# EAGLE design tiny-psu-main-v1.1 (EAGLE 9.6.2)

## Sheet 1 of 2
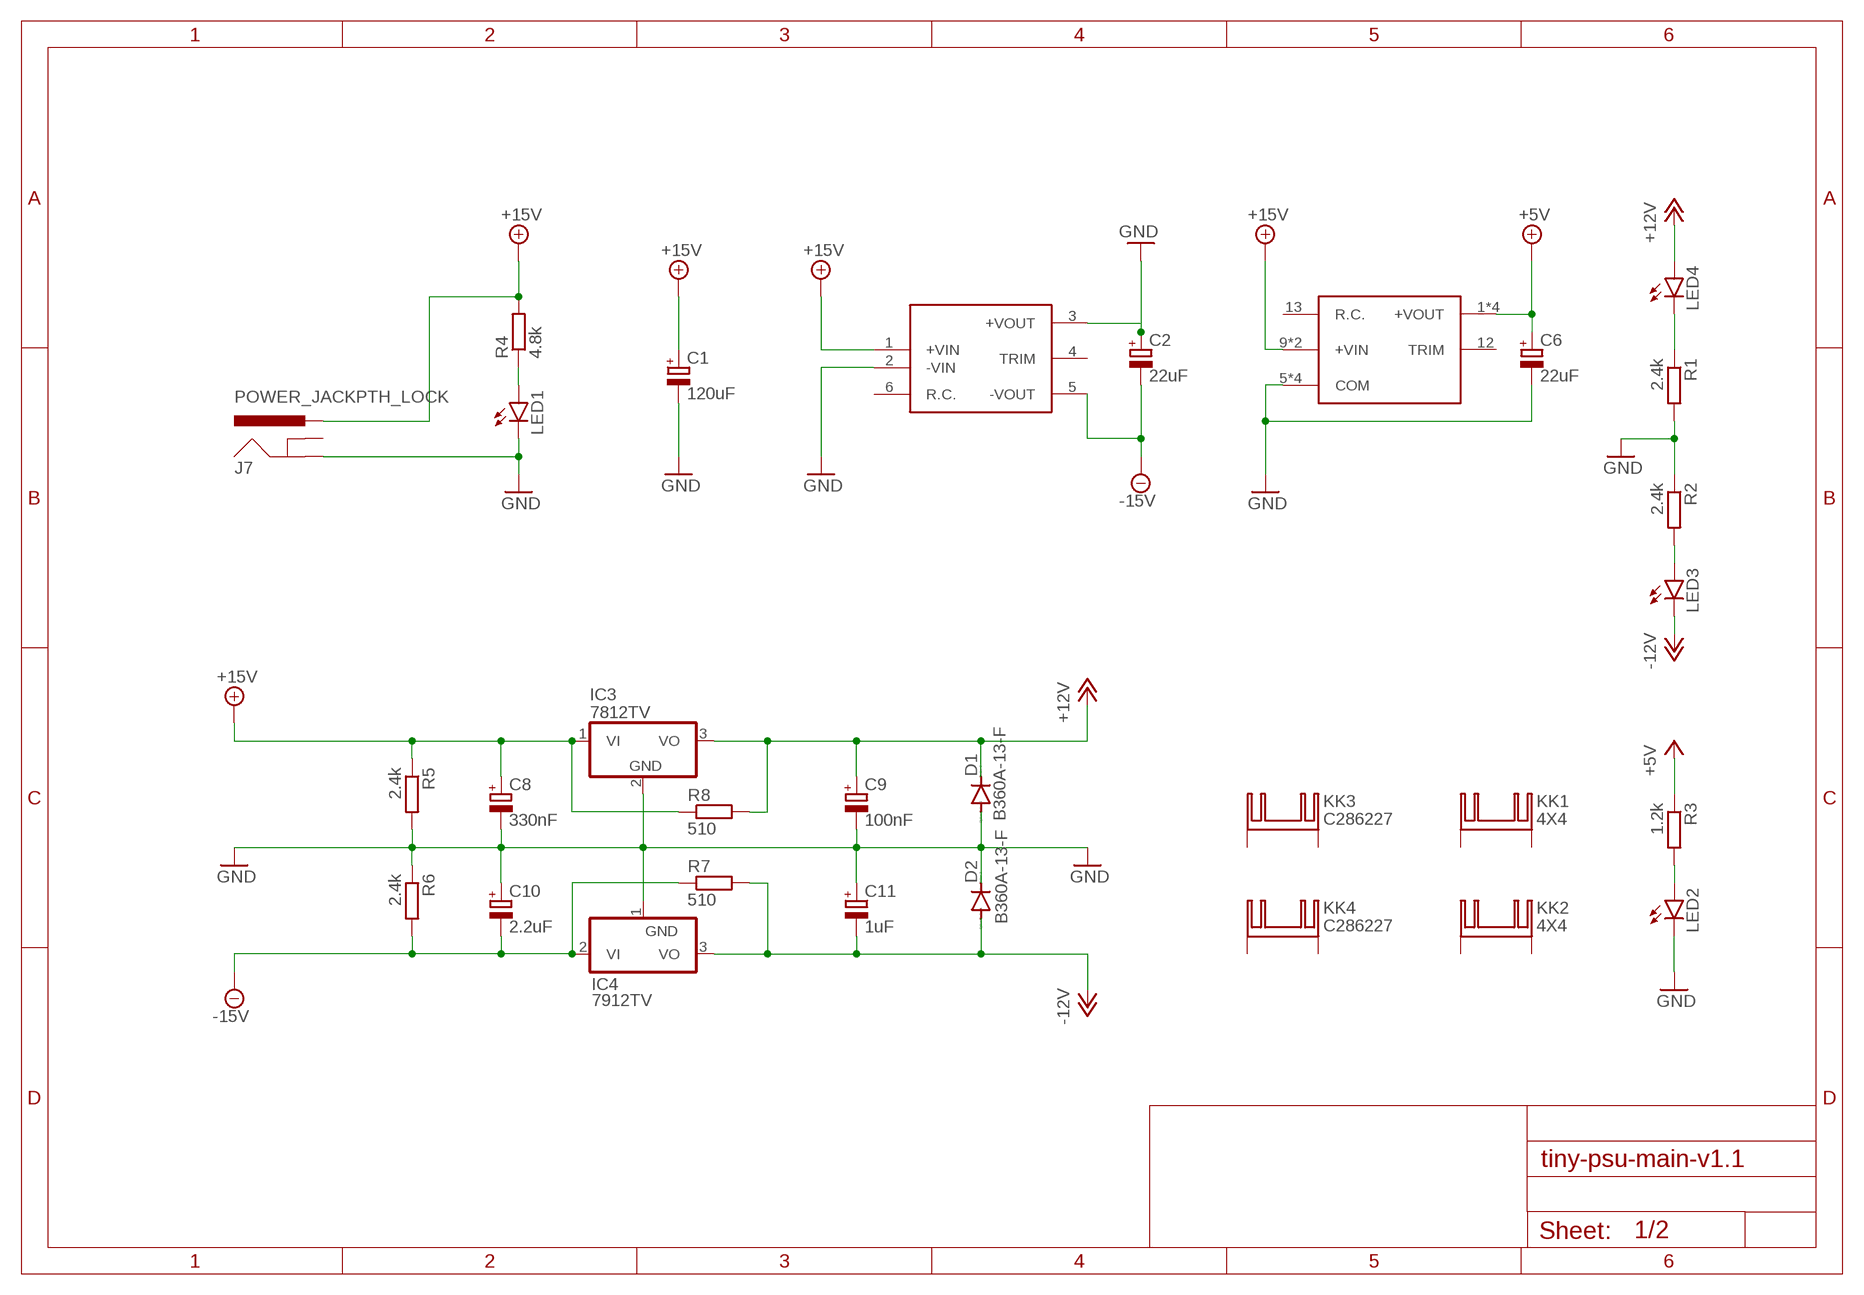
[diagram p0: schematic, sheet 1]

### Parts
C1  120uF  CPOL-EUE5-10.5  [E5-10,5]
C2  22uF  CPOL-EUE2.5-6  [E2,5-6]
C6  22uF  CPOL-EUE2.5-6  [E2,5-6]
C8  330nF  C-POL_TANTALUM-1206(3216-METRIC)  [CAPMP3216X180N]
C9  100nF  C-POL_TANTALUM-1206(3216-METRIC)  [CAPMP3216X180N]
C10  2.2uF  C-POL_TANTALUM-1411(3528-METRIC)  [CAPMP3528X210N]
C11  1uF  C-POL_TANTALUM-1206(3216-METRIC)  [CAPMP3216X180N]
D1  B360A-13-F  DIODE-DO-214AC  [DO-214AC]
D2  B360A-13-F  DIODE-DO-214AC  [DO-214AC]
IC1  SKMW  [SKMW]
IC2  NID100-5  NID65-HORIZONTAL  [NID65-HORIZONTAL]
IC3  7812TV  [TO220V]
IC4  7912TV  [TO220V]
J7  POWER_JACKPTH_LOCK  [POWER_JACK_PTH_LOCK]
KK1  4X4  [4X4]
KK2  4X4  [4X4]
KK3  C286227  [C286227]
KK4  C286227  [C286227]
LED1  LEDCHIP-LED0805  [CHIP-LED0805]
LED2  LEDCHIP-LED0805  [CHIP-LED0805]
LED3  LEDCHIP-LED0805  [CHIP-LED0805]
LED4  LEDCHIP-LED0805  [CHIP-LED0805]
R1  2.4k  R-EU_R0805  [R0805]
R2  2.4k  R-EU_R0805  [R0805]
R3  1.2k  R-EU_R0805  [R0805]
R4  4.8k  R-EU_R0805  [R0805]
R5  2.4k  R-EU_R0805  [R0805]
R6  2.4k  R-EU_R0805  [R0805]
R7  510  R-EU_R0805  [R0805]
R8  510  R-EU_R0805  [R0805]

### Nets
+5V: C6.+ IC2.1(+VOUT) IC2.2(+VOUT) IC2.3(+VOUT) IC2.4(+VOUT) R3.1 ; also sheet 2
+12V: C9.1(+) D1.C IC3.3(VO) LED4.A R8.2 ; also sheet 2
+15V: C1.+ C8.1(+) IC1.1(+VIN) IC2.9(+VIN) IC2.10(+VIN) IC3.1(VI) J7.PWR R4.2 R5.1 R8.1
-12V: C11.2(-) D2.A IC4.3(VO) LED3.C R7.2 ; also sheet 2
-15V: C2.- C10.2(-) IC1.5(-VOUT) IC4.2(VI) R6.2 R7.1
GND: C1.- C2.+ C6.- C8.2(-) C9.2(-) C10.1(+) C11.1(+) D1.A D2.C IC1.2(-VIN) IC1.3(+VOUT) IC2.5(COM) IC2.6(COM) IC2.7(COM) IC2.8(COM) IC3.2(GND) IC4.1(GND) J7.GND LED1.C LED2.C R1.2 R2.1 R5.2 R6.1 ; also sheet 2
N$1: LED4.C R1.1
N$3: LED3.A R2.2
N$7: LED1.A R4.1
N$10: LED2.A R3.2
Unconnected: IC1.4(TRIM) IC1.6(R.C.) IC2.12(TRIM) IC2.13(R.C.) J7.GNDBREAK KK1.A2,1(K) KK1.A2,2(K) KK1.B2,1(K) KK1.B2,2(K) KK2.A2,1(K) KK2.A2,2(K) KK2.B2,1(K) KK2.B2,2(K) KK3.A2,2(K) KK3.B2,2(K) KK4.A2,2(K) KK4.B2,2(K)

## Sheet 2 of 2
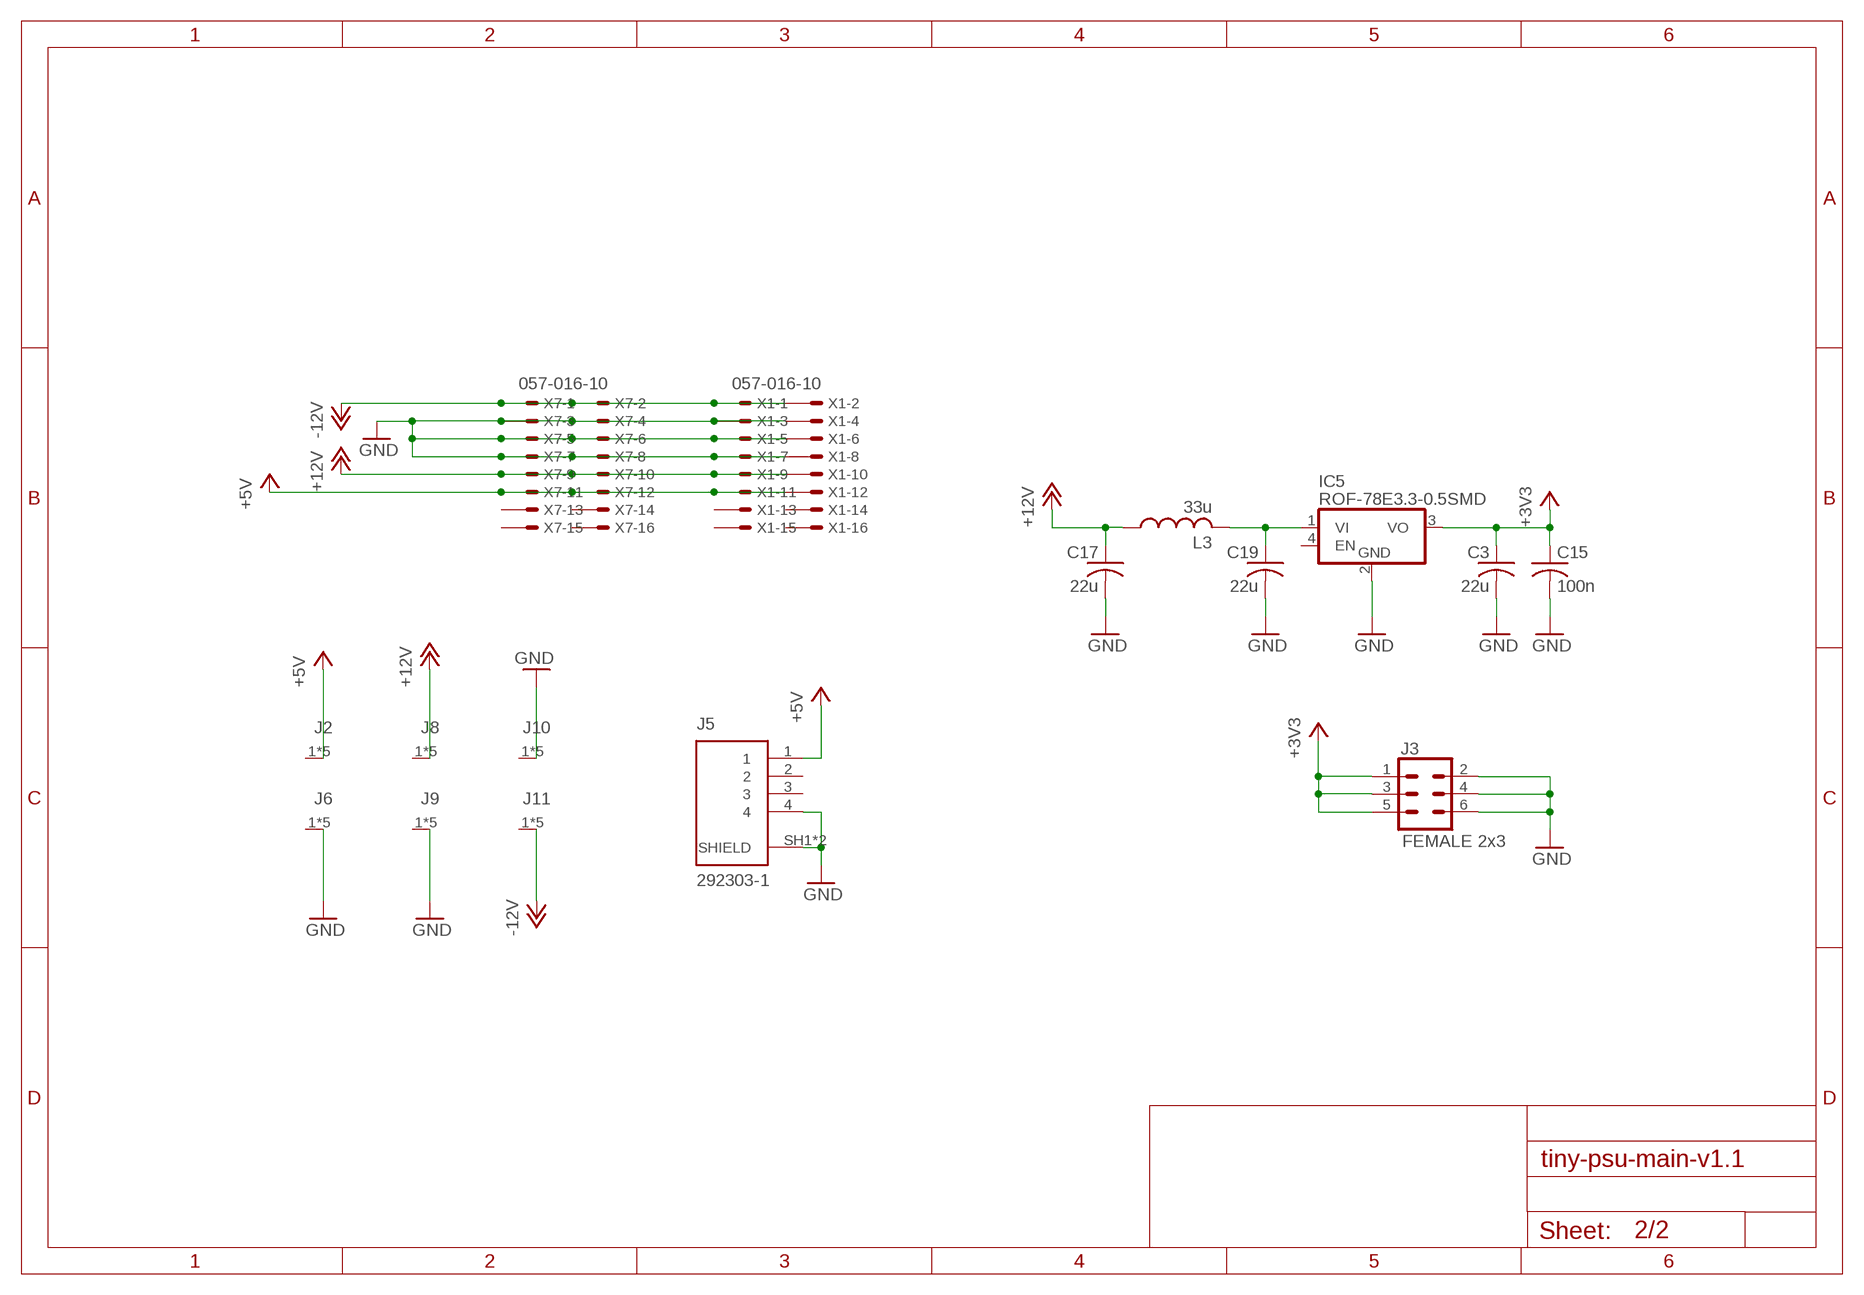
[diagram p1: schematic, sheet 2]

### Parts
C3  22u  C-USC1206  [C1206]
C15  100n  C-USC0402  [C0402]
C17  22u  C-USC1206  [C1206]
C19  22u  C-USC1206  [C1206]
IC5  ROF-78E3.3-0.5SMD  ROF-78EXX-0.55SMD  [ROF78EXX-0.5SMD]
J2  30A-SCREW-CONN  [50X72]
J3  FEMALE 2x3  CONN_03X2FEMALE  [2X3]
J5  292303-1  [292303-1]
J6  30A-SCREW-CONN  [50X72]
J8  30A-SCREW-CONN  [50X72]
J9  30A-SCREW-CONN  [50X72]
J10  30A-SCREW-CONN  [50X72]
J11  30A-SCREW-CONN  [50X72]
L3  33u  L-USL2012C  [L2012C]
X1  057-016-10  [057-016-1]
X7  057-016-10  [057-016-1]

### Nets
+3V3: C3.1 C15.1 IC5.3(VO) J3.1 J3.3 J3.5
+5V: J2.1 J2.2 J2.3 J2.4 J2.P$1 J5.1 X1.11 X1.12 X7.11 X7.12 ; also sheet 1
+12V: C17.1 J8.1 J8.2 J8.3 J8.4 J8.P$1 L3.1 X1.9 X1.10 X7.9 X7.10 ; also sheet 1
-12V: J11.1 J11.2 J11.3 J11.4 J11.P$1 X1.1 X1.2 X7.1 X7.2 ; also sheet 1
GND: C3.2 C15.2 C17.2 C19.2 IC5.2(GND) J3.2 J3.4 J3.6 J5.4 J5.SH1(SHIELD) J5.SH2(SHIELD) J6.1 J6.2 J6.3 J6.4 J6.P$1 J9.1 J9.2 J9.3 J9.4 J9.P$1 J10.1 J10.2 J10.3 J10.4 J10.P$1 X1.3 X1.4 X1.5 X1.6 X1.7 X1.8 X7.3 X7.4 X7.5 X7.6 X7.7 X7.8 ; also sheet 1
N$99: C19.1 IC5.1(VI) L3.2
Unconnected: IC5.4(EN) J5.2 J5.3 X1.13 X1.14 X1.15 X1.16 X7.13 X7.14 X7.15 X7.16

## Library data of the parts
C1 C2 C6 = rcl:CPOL-EU: POLARIZED CAPACITOR, European symbol; SPICEPREFIX: C
C3 C15 C17 C19 = rcl:C-US: CAPACITOR, American symbol
C8-C11 = Capacitor:C-POL: Capacitor Polarised - Generic; CATEGORY: Capacitor
D1 D2 = diode:DIODE-: DIODE
IC1 = meanwell_dcdc:SKMW
IC2 = meanwell_dcdc:NID65-HORIZONTAL
IC3 = ldo:78*: Positive VOLTAGE REGULATOR Source: http://cache.national.com/ds/LM/LM78L05.pdf http://www.fairchildsemi.com/ds/LM/LM7805.pdf
IC4 = ldo:79*: Positive VOLTAGE REGULATOR Source: http://cache.national.com/ds/LM/LM78L05.pdf http://www.fairchildsemi.com/ds/LM/LM7805.pdf
IC5 = og-vreg:ROF-78EXX-0.55SMD
J2 J6 J8-J11 = conn-screw:30A-SCREW-CONN
J3 = SparkFun-Connectors:CONN_03X2: Multi connection point. Often used as Generic Header-pin footprint for 0.1 inch spaced/style header connections You can populate with any combo of single row headers, but if you'd like an exact match, check these: Header - 2x3 (Male, 0.1") <https://www.sparkfun.com/products/12807> (PRT-12807) Header - 2x3 (Female, 0.1") <https://www.sparkfun.com/products/13010> (PRT-13010) 2x3 Pin Shrouded Header <https://www.sparkfun.com/products/10877> (PRT-10877) On any of the 0.1 inch spaced packages, you can populate with these: Break Away Headers - Straight <https://www.sparkfun.com/products/116> (PRT-00116) Break Away Male Headers - Right Angle <https://www.sparkfun.com/products/553> (PRT-00553) Female Headers <https://www.sparkfun.com/products/115> (PRT-00115) Break Away Headers - Machine Pin <https://www.sparkfun.com/products/117> (PRT-00117) Break Away Female Headers - Swiss Machine Pin <https://www.sparkfun.com/products/743> (PRT-00743) Special note: the shrouded connector mates well with our 3x2 ribbon cables: Ribbon Crimp Connector - 6-pin (2x3, Female) <https://www.sparkfun.com/products/10651> (PRT-10651) Ribbon Cable - 6 wire (15ft) <https://www.sparkfun.com/products/10646> (PRT-10646); PROD_ID: CONN-11566
J5 = USB connector:292303-1: CONN RCPT USB2.0 TYPEA 4POS R/A Manufacturer's datasheet <https://www.te.com/commerce/DocumentDelivery/DDEController?Action=srchrtrv&DocNm=292303&DocType=Customer+Drawing&DocLang=English>; CREATED_BY: PCBLayout.com; DIGIKEY_PARTNO: A31726-ND; MANUFACTURER: TE Connectivity AMP Connectors; MPN: 292303-1
J7 = SparkFun-Connectors:POWER_JACK: Power Jack Connector This is the standard 5.5mm barrel jack for power. The PTH is the most common, proven, reliable, footprint. The Slot footprint only works if the mill layer is transmitted to the PCB fab house so be warned. Here are the connectors we sell at SparkFun: DC Barrel Power Jack/Connector <https://www.sparkfun.com/products/119> (PRT-00119) DC Barrel Power Jack/Connector (SMD) <https://www.sparkfun.com/products/12748> (PRT-12748) DC Barrel Jack Adapter - Breadboard Compatible <https://www.sparkfun.com/products/10811> (PRT-10811) It is used on this SparkFun product (and many, many others): SparkFun RedBoard - Programmed with Arduino <https://www.sparkfun.com/products/12757> (DEV-12757) Also, if you need a mating power supply or connector, please check these out: Wall Adapter Power Supply - 9VDC 650mA <https://www.sparkfun.com/products/298> (TOL-00298) DC Barrel Jack Adapter - Male <https://www.sparkfun.com/products/10287> (PRT-10287); PROD_ID: CONN-08197; SF_ID: PRT-00119
KK1 KK2 = biti:4X4: HEATSINK manufacturer Fischer/distributor Buerklin
KK3 KK4 = biti:C286227: HEATSINK manufacturer Fischer/distributor Buerklin
L3 = og-rcl:L-US
LED1-LED4 = led:LED: LED OSRAM: - CHIPLED LG R971, LG N971, LY N971, LG Q971, LY Q971, LO R971, LY R971 LH N974, LH R974 LS Q976, LO Q976, LY Q976 LO Q996 - Hyper CHIPLED LW Q18S LB Q993, LB Q99A, LB R99A - SideLED LS A670, LO A670, LY A670, LG A670, LP A670 LB A673, LV A673, LT A673, LW A673 LH A674 LY A675 LS A676, LA A676, LO A676, LY A676, LW A676 LS A679, LY A679, LG A679 - Hyper Micro SIDELED® LS Y876, LA Y876, LO Y876, LY Y876 LT Y87S - SmartLED LW L88C, LW L88S LB L89C, LB L89S, LG L890 LS L89K, LO L89K, LY L89K LS L896, LA L896, LO L896, LY L896 - TOPLED LS T670, LO T670, LY T670, LG T670, LP T670 LSG T670, LSP T670, LSY T670, LOP T670, LYG T670 LG T671, LOG T671, LSG T671 LB T673, LV T673, LT T673, LW T673 LH T674 LS T676, LA T676, LO T676, LY T676, LB T676, LH T676, LSB T676, LW T676 LB T67C, LV T67C, LT T67C, LS T67K, LO T67K, LY T67K, LW E67C LS E67B, LA E67B, LO E67B, LY E67B, LB E67C, LV E67C, LT E67C LW T67C LS T679, LY T679, LG T679 LS T770, LO T770, LY T770, LG T770, LP T770 LB T773, LV T773, LT T773, LW T773 LH T774 LS E675, LA E675, LY E675, LS T675 LS T776, LA T776, LO T776, LY T776, LB T776 LHGB T686 LT T68C, LB T68C - Hyper Mini TOPLED® LB M676 - Mini TOPLED Santana® LG M470 LS M47K, LO M47K, LY M47K Source: http://www.osram.convergy.de LUXEON: - LUMILED® LXK2-PW12-R00, LXK2-PW12-S00, LXK2-PW14-U00, LXK2-PW14-V00 LXK2-PM12-R00, LXK2-PM12-S00, LXK2-PM14-U00 LXK2-PE12-Q00, LXK2-PE12-R00, LXK2-PE12-S00, LXK2-PE14-T00, LXK2-PE14-U00 LXK2-PB12-K00, LXK2-PB12-L00, LXK2-PB12-M00, LXK2-PB14-N00, LXK2-PB14-P00, LXK2-PB14-Q00 LXK2-PR12-L00, LXK2-PR12-M00, LXK2-PR14-Q00, LXK2-PR14-R00 LXK2-PD12-Q00, LXK2-PD12-R00, LXK2-PD12-S00 LXK2-PH12-R00, LXK2-PH12-S00 LXK2-PL12-P00, LXK2-PL12-Q00, LXK2-PL12-R00 Source: www.luxeon.com KINGBRIGHT: KA-3528ASYC Source: www.kingbright.com
R1-R8 = rcl:R-EU_: RESISTOR, European symbol; SPICEPREFIX: R
X1 X7 = conn-fc:057-016-1: CONNECTOR 10-pin series 057 contact pc board low profile headers; OC_FARNELL: unknown; OC_NEWARK: unknown

## Board
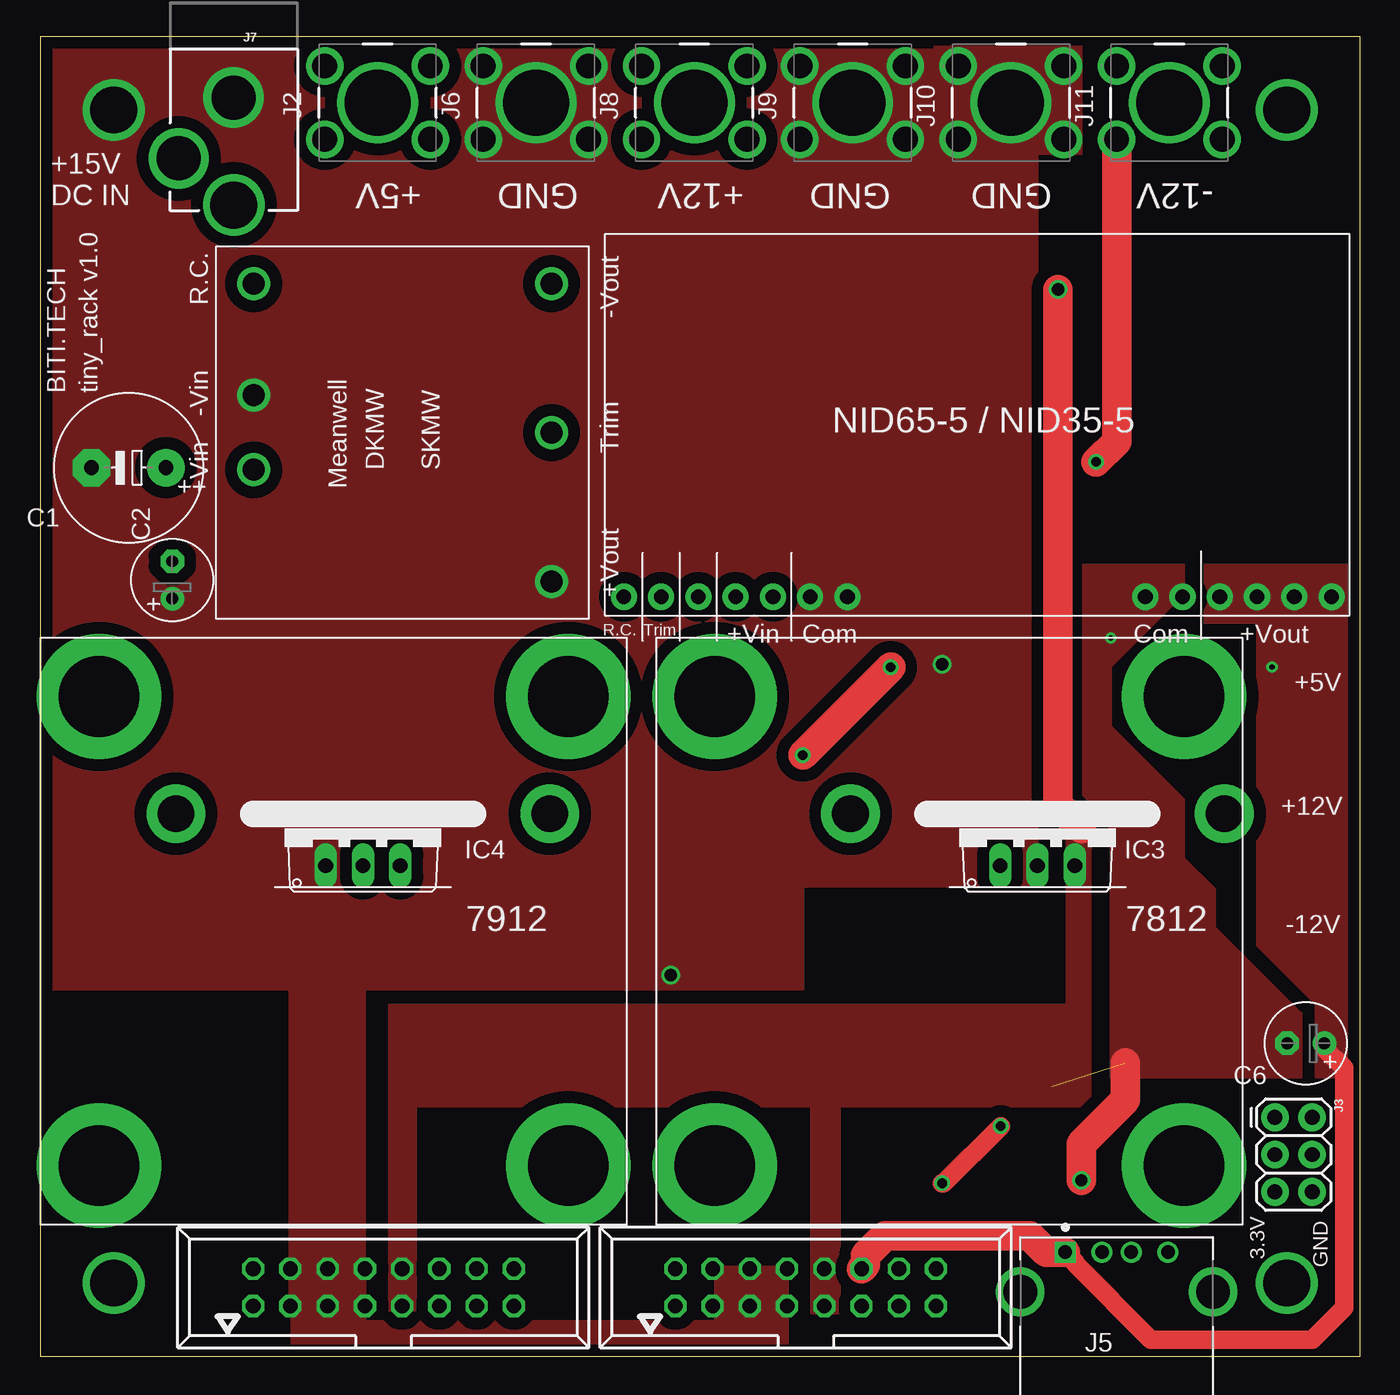
[diagram p2: board, top side]
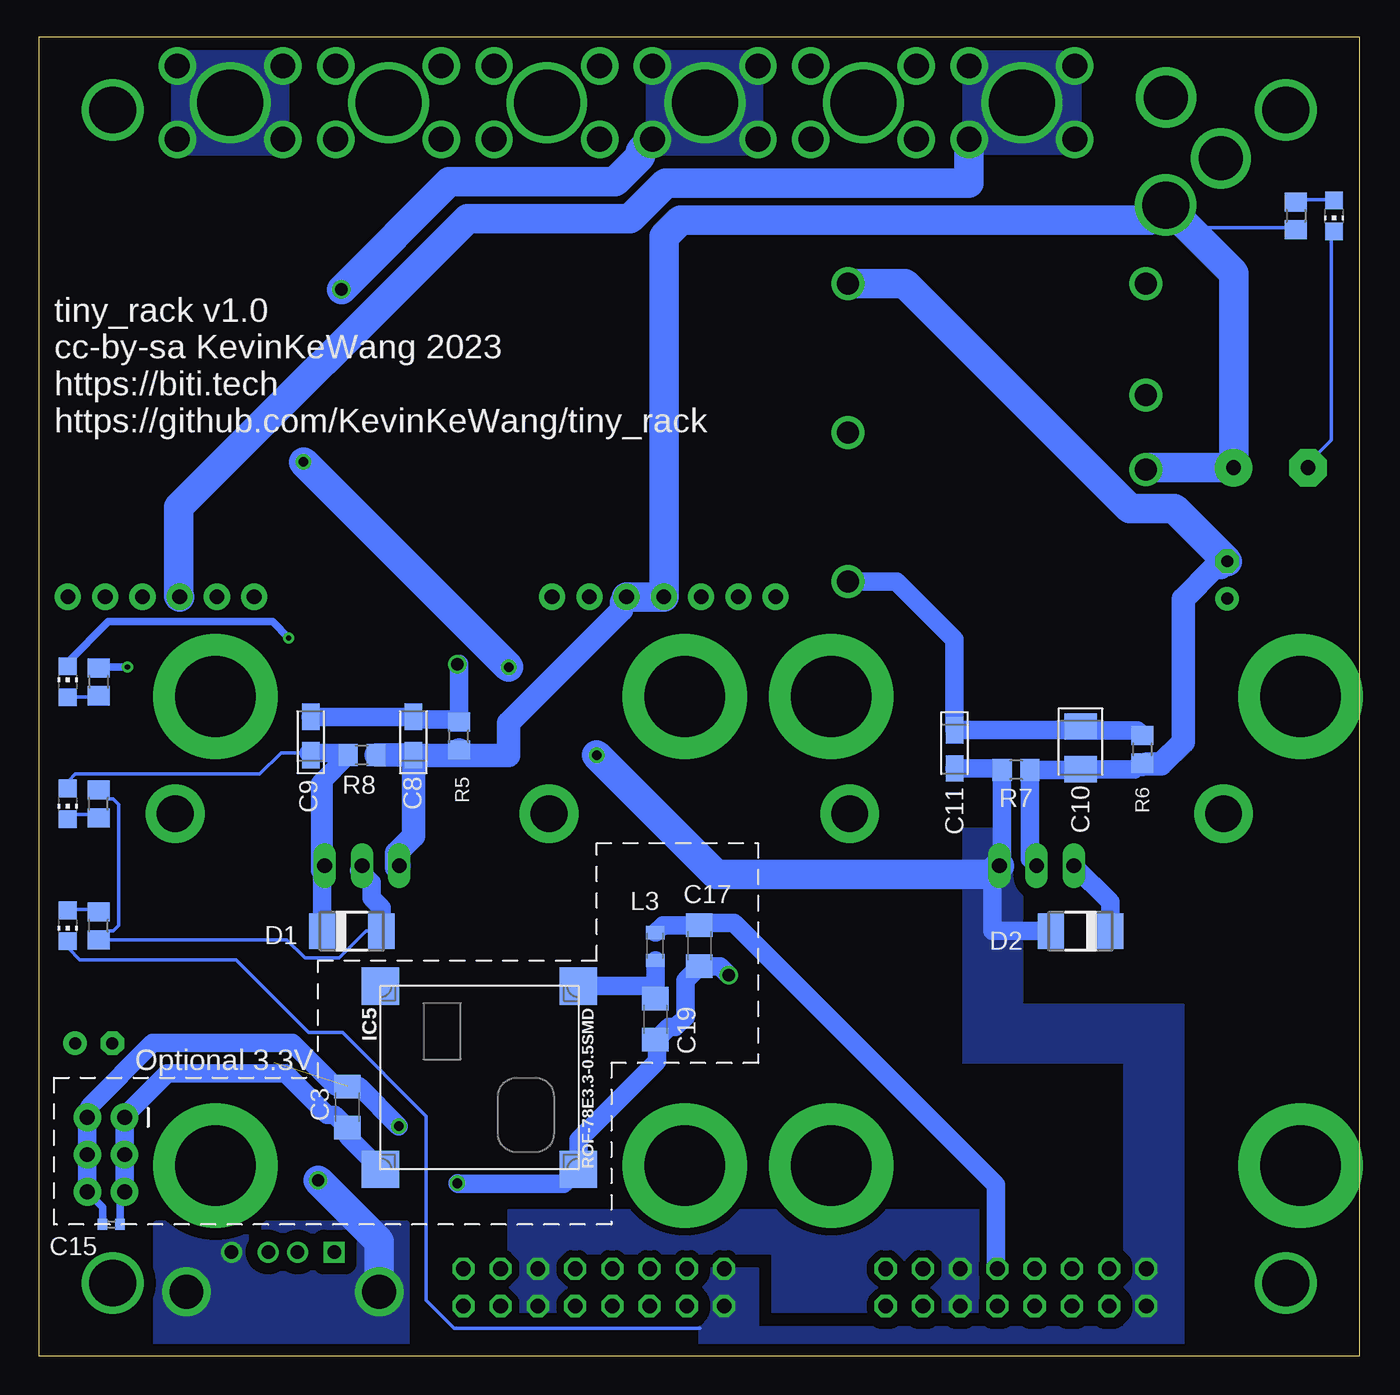
[diagram p3: board, bottom side, seen from below]

Size 90 x 90 mm. Coordinates in mm from the lower left corner, seen from the top.
Outline: 0,0 90,0 90,90 0,90 0,0
Copper layers (1+2*15+16): Top 0.035mm / dielectric 0.3mm / Route2 0.035mm / dielectric 0.75mm / Route15 0.035mm / dielectric 0.3mm / Bottom 0.035mm
Design rules "default *": minimum track width 10mil, minimum drill 0.35mm, track to track 20mil, track to pad 20mil, pad to pad 20mil, via to via 20mil, smd to smd 6mil, copper to edge 20mil, drill to drill 6mil, minimum pad ring 10mil, minimum via ring 8mil, stop-mask expansion 4mil, vias tented up to drill 0mil, thermal gap 10mil

### Footprints (pad centres in the part's own frame; a part is rotated, then mirrored left to right if it is on the bottom)
E5-10,5 = drill 1.016 pad 2.54: + -2.54,0 | drill 1.016 pad 2.54 octagon: - 2.54,0
E2,5-6 = drill 0.813 pad 1.6: + -1.27,0 | drill 0.813 pad 1.6 octagon: - 1.27,0
C1206 = smd 1.6 x 1.8: 1 -1.4,0; 2 1.4,0
CAPMP3216X180N = smd 1.796 x 1.189: 1 -1.31,0; 2 1.31,0
CAPMP3528X210N = smd 1.796 x 2.204: 1 -1.46,0; 2 1.46,0
C0402 = smd 0.65 x 0.75: 1 -0.6,0; 2 0.6,0
DO-214AC = smd 1.8 x 2.4: A 2.025,0; C -2.025,0
SKMW = drill 1.5: 1 -2.54,10.16; 2 2.54,10.16; 3 -10.16,-10.16; 4 0,-10.16; 5 10.16,-10.16; 6 10.16,10.16
NID65-HORIZONTAL = drill 1 pad 1.778: 1 -24.16,0; 2 -21.62,0; 3 -19.08,0; 4 -16.54,0; 5 -14,0; 6 -11.46,0; 7 8.86,0; 8 11.4,0; 9 13.94,0; 10 16.48,0; 11 19.02,0; 12 21.56,0; 13 24.1,0
TO220V = drill 1.016 long: 1 -2.54,-2.54; 2 0,-2.54; 3 2.54,-2.54
ROF78EXX-0.5SMD = smd 2.54 x 2.54: 1 -6.25,6.75; 2 6.25,6.75; 3 6.25,-6.75; 4 -6.25,-6.75
50X72 = drill 1.7: 1 -2.5,3.6; 2 2.5,3.6; 3 2.5,-3.6; 4 -2.5,-3.6 | drill 4.5: P$1 0,0
2X3 = drill 1.016 pad 1.88: 1 0,0; 2 0,2.54; 3 2.54,0; 4 2.54,2.54; 5 5.08,0; 6 5.08,2.54
292303-1 = drill 0.92 square: 1 -3.5,2.71 | drill 0.92: 2 -1,2.71; 3 1,2.71; 4 3.5,2.71 | drill 2.3: SH1 -6.57,0; SH2 6.57,0
POWER_JACK_PTH_LOCK = drill 2.997 pad 4.115: GND 0.025,6.557; GNDBREAK 3.762,10.7 | drill 3.2 pad 4.115: PWR 0,13.878
4X4 = drill 5.5 pad 8.5: A2,1 -16,-16; A2,2 -16,16; B2,1 16,-16; B2,2 16,16
C286227 = drill 2.5 pad 4: A2,2 -12.75,0; B2,2 12.75,0
L2012C = smd 0.9 x 1.25: 1 -0.9,0; 2 1,0
CHIP-LED0805 = smd 1.2 x 1.2: A 0,-1.05; C 0,1.05
R0805 = smd 1.3 x 1.5: 1 -0.95,0; 2 0.95,0
057-016-1 = drill 1 octagon: 1 -8.89,-1.27; 2 -8.89,1.27; 3 -6.35,-1.27; 4 -6.35,1.27; 5 -3.81,-1.27; 6 -3.81,1.27; 7 -1.27,-1.27; 8 -1.27,1.27; 9 1.27,-1.27; 10 1.27,1.27; 11 3.81,-1.27; 12 3.81,1.27; 13 6.35,-1.27; 14 6.35,1.27; 15 8.89,-1.27; 16 8.89,1.27

### Placement (x,y rotation side)
C1  6.03,60.6 180 top
C2  9,52.95 90 top
C3  69,17 90 bottom
C6  86.3,21.35 180 top
C8  64.5,42.3 90 bottom
C9  71.5,42.3 90 bottom
C10  19,41.5 270 bottom
C11  27.6,41.4 270 bottom
C15  85.1,9 180 bottom
C17  45,28 270 bottom
C19  48,23 270 bottom
D1  68.7,29 0 bottom
D2  19,29 180 bottom
IC1  24.7,63 90 top
IC2  63.9,51.8 180 top
IC3  68,36 0 top
IC4  22,36 0 top
IC5  60,19 270 bottom
J2  23,85.5 90 top
J3  84.2,16.3 270 top
J5  73.4,4.4 0 top
J6  33.8,85.5 90 top
J7  13.2,92.4 180 top
J8  44.6,85.5 90 top
J9  55.4,85.5 90 top
J10  66.2,85.5 90 top
J11  77,85.5 90 top
KK1  20,29 0 top
KK2  62,29 0 top
KK3  22,37 0 top
KK4  68,37 0 top
L3  48,28 270 bottom
LED1  1.72,77.78 180 bottom
LED2  88.08,46 0 bottom
LED3  88.08,29.36 180 bottom
LED4  88.08,37.68 180 bottom
R1  85.98,37.68 90 bottom
R2  85.98,29.36 90 bottom
R3  85.98,46 270 bottom
R4  4.32,77.78 270 bottom
R5  61.4,42.3 90 bottom
R6  14.8,41.4 270 bottom
R7  23.4,40 180 bottom
R8  68,41 180 bottom
X1  52.2,4.7 0 top
X7  23.4,4.7 0 top

### Tracks (layer width: path | path; a pad name or v marks a point on that pad's centre or on a via)
+3V3
  Bottom 0.254: 68.96,15.24 C3.1
  Bottom 0.508: C15.1 84.5,10.92 J3.5
  Bottom 1.27: IC5.3 68.96,14.96 68.96,15.24 | C3.1 69.86,16.46 70.37,16.46 73.22,19.3 81.3,19.3 84.2,16.4 J3.1 J3.3 J3.5
+5V  (via drill 0.35)
  Top 1.27: J5.1 70.54,6.47 70.54,6.34 75.74,1.14 86.74,1.14 88.92,3.33 88.92,19.66 87.57,21.02 C6.+
  Top 2: J5.1 68.6,7.11 67.47,8.23 57.61,8.23 56.29,6.91 56.29,6.25 X1.12
  Bottom 0.254: 85.72,47.24 R3.1
  Bottom 0.508: R3.1 85.93,47 v84,47
  Bottom 2: IC2.4 80.5,51.86 80.5,57.92 60.82,77.6 49.72,77.6 47.32,80 26.6,80 J2.4
  pour Bottom (isolate 0.813, no thermals): 19,89 19,82 27,82 27,89
  pour Top (isolate 0.813, no thermals): 79.4,54 90,54 90,19 87,19 87,24 83,28 83,50 79.4,50
  pour Bottom (no thermals): 26,9 26,3 40,3 40,7 52,7 54,7 54,3 58,3 58,10 26,10
+12V  (via drill 0.85)
  Top 2: v69.4,72.76 69.4,37.6 71,36
  Bottom 0.254: LED4.A 88.01,38.86 88.01,39.24 87.55,39.7 74.98,39.7 73.53,41.15 71.63,41.15 C9.1 71.25,41.15 70.1,41.15 | 70.1,41.15 68.96,41.15 R8.2 | 47.98,28.9 L3.1 | D1.C 70.87,29.34 70.87,33.15 IC3.3 70.48,33.53 70.1,33.91 70.1,41.15 | 24.77,6.1 X7.10
  Bottom 1.27: 24.77,6.1 24.77,11.68 42.63,29.54 44.86,29.54 C17.1 47.49,29.4 47.98,28.9 | 71.63,41.15 69.1,41.15 R8.2 70.87,39.08 70.87,33.15 | D1.C 70.72,33.27 IC3.3
  Bottom 2: v69.4,72.76 62.06,80.11 50.76,80.11 49.02,81.85 49.02,82.18 J8.4
  pour Top (isolate 0.813, no thermals): 70,36 71.6,36 71.6,17 54.5,17 54.5,2.9 52.6,2.9 52.6,17 25.6,17 25.6,3.1 23.8,3.1 23.8,24 70,24
  pour Bottom (isolate 0.813, no thermals): 40.7,89 48.6,89 48.6,82 40.7,82
+15V
  Bottom 0.254: 14.48,60.58 IC1.1 | R4.2 4.57,76.96 11.43,76.96 12.95,78.49 J7.PWR | 8.76,60.96 C1.+ | 67.01,41.02 R8.1
  Bottom 1.6: C8.1 64.5,35.5 65.65,34.35 65.65,33.35 65.57,33.35 IC3.1 | R8.1 C8.1 | C8.1 61.76,40.99 | 61.76,40.99 61.46,41.29 61.4,41.29 | IC2.9 50.3,51.46 50.3,50.89 58,43.19 58,41 58.01,40.99 60,40.99 61.04,40.99 | 61.04,40.99 61.76,40.99 | R5.1 61.04,40.99
  Bottom 2: 14.48,60.58 14.46,60.6 C1.+ 8.56,73.89 J7.PWR 14.23,77.49 46.28,77.49 47.42,76.35 IC2.10 IC2.9
-12V  (via drill 0.65)
  Top 2: v52,41 v58,47 | v72,61 73.4,62.4 J11.1
  Bottom 0.254: 44.96,1.91 61.72,1.91 63.63,3.81 63.63,16.38 69.34,22.1 71.63,22.1 76.58,27.05 87.25,27.05 88.01,27.81 88.01,28.19 LED3.C | 23,28.96 21.34,28.96 D2.A | 24.38,35.81 24.38,39.62 R7.2
  Bottom 1.27: C11.2 24.44,40.09 R7.2 24.35,33.65 IC4.3 25,33 25,29 D2.A
  Bottom 2: IC4.3 25.14,32.86 43.86,32.86 v52,41 | v58,47 v72,61
  pour Bottom (isolate 0.813, no thermals): 23,36 23,24 12,24 12,0 45,0 45,6 41,6 41,2 16,2 16,20 27,20 27,36
  pour Bottom (isolate 0.813, no thermals): 73,89 81,89 81,82 73,82
-15V
  Bottom 0.254: 15,40.39 14.86,40.39 R6.2 14.48,40.39
  Bottom 1.27: IC4.2 22.45,33.91 R7.1 19.04,40 C10.2 15.35,40.04 15,40.39 | 14.8,40.19 R6.2
  Bottom 1.6: C2.- 9.43,53.79 9.87,53.79 12,51.66 12,41.9 13.51,40.39 14.48,40.39
  Bottom 2: C2.- 12.61,57.83 15.63,57.83 30.96,73.16 IC1.5
GND  (via drill 0.35, 0.65, 0.8, 0.85, 3.2)  (1 unrouted)
  Top 1.27: v65.5,15.7 61.6,11.8 v61.5,11.8
  Top 2: v71,12 71,14.5 74,17.5 74,20
  Bottom 0.254: 64.39,43.43 C8.2 | 47.89,21.64 C19.2 | R6.1 14.86,42.67 18.67,42.67 C10.1 19.05,42.67 27.43,42.67 C11.1 | LED1.C 1.91,76.58 1.91,62.48 3.43,60.96 C1.- | 68.2,33.15 IC3.2 | 61.34,43.05 R5.2 | D1.A 67.73,29 69.56,27.16 71.89,27.16 73.13,28.41 R2.1 85.36,29.03 84.96,29.03 84.59,29.4 84.59,37.64 84.96,38.02 85.36,38.02 R1.2
  Bottom 0.508: J3.6 85.7,10.18 C15.2 | LED2.C 88.08,47.33 85.3,50.1 74.1,50.1 v73,49
  Bottom 1.27: R6.1 15.12,42.67 19.05,42.67 | C10.1 19.25,42.71 C11.1 27.6,48.88 31.56,52.84 IC1.3 | D2.C 16.98,30.98 IC4.1 | D1.A 66.67,30.59 67.36,31.28 67.36,32.31 68.2,33.15 | v43,26 43.6,26.6 C17.2 45.96,25.64 45.96,23.13 46.63,22.46 47.06,22.46 47.89,21.64 47.89,20.11 53.25,14.75 IC5.2 54.25,11.75 61.45,11.75 v61.5,11.8 | 64.39,43.43 61.58,43.43 R5.2 61.4,47.2 v61.5,47.2 | C9.2 C8.2 | v65.5,15.7 68.2,18.4 C3.2 69.8,18.4 72.78,21.38 82.27,21.38 86.58,17.06 86.58,16.94 86.74,16.79 J3.2 J3.4 J3.6
  Bottom 2: J5.SH1 66.83,7.83 v71,12
  other vias: 5,85
  pour Top (isolate 0.813, no thermals): 0,90 68,90 68,32 52,32 52,25 22.1,25 22.1,3.2 17,3.2 17,25 0,25
  pour Top (isolate 0.813, no thermals): 17.1,5.9 17.1,0 51,0 51,6.1 46,6.1 46,2.4 22.2,2.4 22.2,5.9
  pour Bottom (isolate 0.813, no thermals): 67,9 82,9 82,0 65,0 65,9
  pour Top (isolate 0.61, no thermals): 71,54 78,54 78,52 73,47 73,43 78,38 78,34 80.1,31.9 80.1,29.3 86,23.4 86,19 73,19 73,36 71,38
  pour Top (isolate 0.61, no thermals): 61,90 71,90 71,82 61,82
GND1  (via drill 3.2)
  other vias: 85,85
GND2  (via drill 3.2)
  other vias: 5,5
GND3  (via drill 3.2)
  other vias: 85,5
N$1
  Bottom 0.254: LED4.C 88.01,36.96 86.11,36.96 R1.1
N$3
  Bottom 0.254: LED3.A 88.01,30.48 86.11,30.48 R2.2
N$7
  Bottom 0.254: LED1.A 1.91,78.87 4.19,78.87 R4.1
N$10
  Bottom 0.254: LED2.A 88.01,44.96 86.11,44.96 R3.2
N$99
  Bottom 0.254: 48.01,25.53 48.01,24.77 C19.1 | 48.01,25.53 48.01,26.67 L3.2 | 48.01,25.53 52.96,25.53 IC5.1
  Bottom 1.27: L3.2 C19.1 | IC5.1 48.49,25.25 48.01,24.77

### Text on the board
bPlace: Optional 3.3V
tNames: +5V | GND | +12V | GND | GND | -12V | +15V / DC IN | BITI.TECH | tiny_rack v1.0 | NID65-5 / NID35-5 | +5V | +12V | 7912 | 7812 | -12V | 3.3V | GND
bNames: tiny_rack v1.0 / cc-by-sa KevinKeWang 2023 / https://biti.tech / https://github.com/KevinKeWang/tiny_rack